# Altium schematic sheet NFC_Access_Ethernet_R00.SchDoc: NFC Access Board
size A4; Author: Hernan M. Travado; CompanyName: UTN FRBA; Revision: 1.0; SheetNumber: 4; SheetTotal: 7
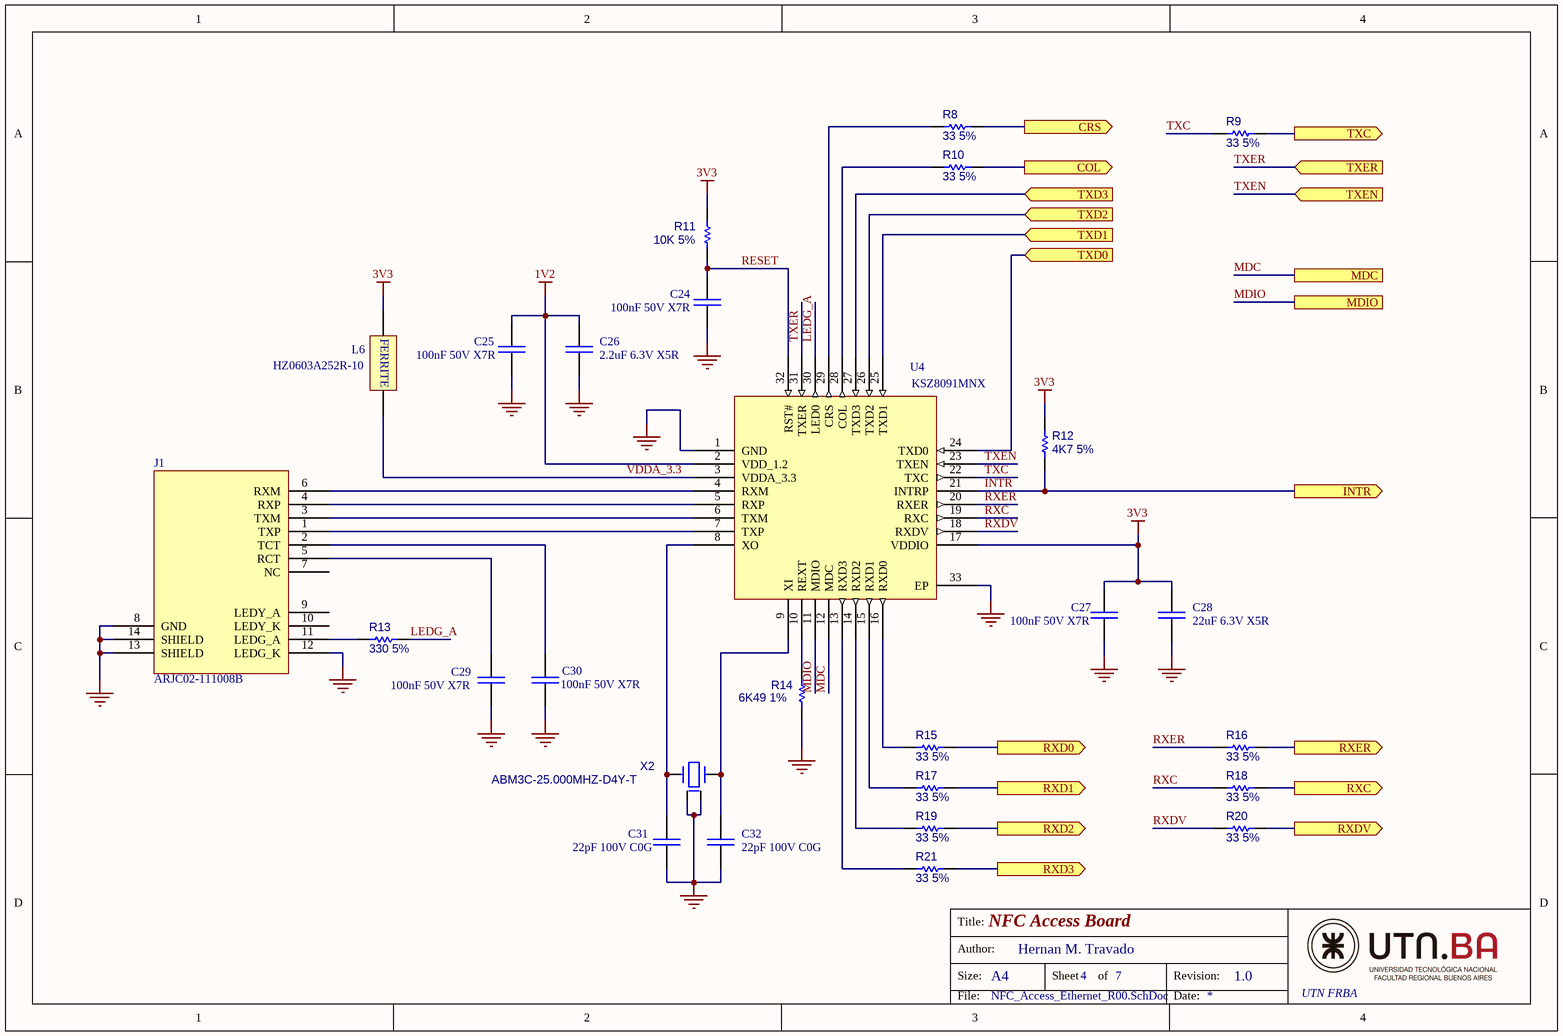
[diagram p0: NFC_Access_Ethernet_R00.SchDoc]

## Parts
C24  100nF 50V X7R  [C_0603]
C25  100nF 50V X7R  [C_0603]
C26  2.2uF 6.3V X5R  [C_0603]
C27  100nF 50V X7R  [C_0603]
C28  22uF 6.3V X5R  [C_0603]
C29  100nF 50V X7R  [C_0603]
C30  100nF 50V X7R  [C_0603]
C31  22pF 100V C0G  [C_0603]
C32  22pF 100V C0G  [C_0603]
J1  ARJC02-111008B  [ARJC02-111008B]
L6  HZ0603A252R-10  [F_0603]
R8  33 5%  [R_0603]
R9  33 5%  [R_0603]
R10  33 5%  [R_0603]
R11  10K 5%  [R_0603]
R12  4K7 5%  [R_0603]
R13  330 5%  [R_0603]
R14  6K49 1%  [R_0603]
R15  33 5%  [R_0603]
R16  33 5%  [R_0603]
R17  33 5%  [R_0603]
R18  33 5%  [R_0603]
R19  33 5%  [R_0603]
R20  33 5%  [R_0603]
R21  33 5%  [R_0603]
U4  KSZ8091MNX  [QFN32]
X2  ABM3C-25.000MHZ-D4Y-T  [ABM3C]

## Ports
COL (out, see NFC_Access_MainPage_R00[3B], NFC_Access_CPU1_R00[2A]), CRS (out, see NFC_Access_MainPage_R00[3B], NFC_Access_CPU1_R00[2A]), INTR (out, see NFC_Access_MainPage_R00[3B], NFC_Access_CPU1_R00[3A]), MDC (see NFC_Access_MainPage_R00[3B], NFC_Access_CPU1_R00[3A]), MDIO (see NFC_Access_MainPage_R00[3B], NFC_Access_CPU1_R00[2A]), RXC (out, see NFC_Access_MainPage_R00[3B], NFC_Access_CPU1_R00[2A]), RXD0 (out, see NFC_Access_MainPage_R00[3A], NFC_Access_CPU1_R00[3A]), RXD1 (out, see NFC_Access_MainPage_R00[3B], NFC_Access_CPU1_R00[3A]), RXD2 (out, see NFC_Access_MainPage_R00[3B], NFC_Access_CPU1_R00[2B]), RXD3 (out, see NFC_Access_MainPage_R00[3B], NFC_Access_CPU1_R00[2B]), RXDV (out, see NFC_Access_MainPage_R00[3B], NFC_Access_CPU1_R00[2A]), RXER (out, see NFC_Access_MainPage_R00[3B], NFC_Access_CPU1_R00[2C]), TXC (out, see NFC_Access_MainPage_R00[3B], NFC_Access_CPU1_R00[3A]), TXD0 (in, see NFC_Access_MainPage_R00[3B], NFC_Access_CPU1_R00[2C]), TXD1 (in, see NFC_Access_MainPage_R00[3B], NFC_Access_CPU1_R00[2C]), TXD2 (in, see NFC_Access_MainPage_R00[3B], NFC_Access_CPU1_R00[3A]), TXD3 (in, see NFC_Access_MainPage_R00[3B], NFC_Access_CPU1_R00[3C]), TXEN (in, see NFC_Access_MainPage_R00[3B], NFC_Access_CPU1_R00[2C]), TXER (in, see NFC_Access_MainPage_R00[3B], NFC_Access_CPU1_R00[3A])

## Nets
1V2: C25.1 C26.1 U4.2(VDD_1.2)
3V3: C27.1 C28.1 L6.1 R11.1 R12.1 U4.17(VDDIO)
GND: C24.2 C25.2 C26.2 C27.2 C28.2 C29.2 C30.2 C31.2 C32.2 J1.8(GND) J1.12(LEDG_K) J1.13(SHIELD) J1.14(SHIELD) R14.2 U4.1(GND) U4.33(EP) X2.2 X2.4
COL: R10.2 ; port COL
CRS: R8.2 ; port CRS
INTR: R12.2 U4.21(INTRP) ; port INTR
LEDG_A: R13.1 U4.30(LED0)
MDC: U4.12(MDC) ; port MDC
MDIO: U4.11(MDIO) ; port MDIO
RESET: C24.1 R11.2 U4.32(RST#)
RXC: R18.1 U4.19(RXC)
RXC: R18.2 ; port RXC  [a separate net that carries the same name]
RXD0: R15.2 ; port RXD0
RXD1: R17.2 ; port RXD1
RXD2: R19.2 ; port RXD2
RXD3: R21.2 ; port RXD3
RXDV: R20.1 U4.18(RXDV)
RXDV: R20.2 ; port RXDV  [a separate net that carries the same name]
RXER: R16.1 U4.20(RXER)
RXER: R16.2 ; port RXER  [a separate net that carries the same name]
TXC: R9.1 U4.22(TXC)
TXC: R9.2 ; port TXC  [a separate net that carries the same name]
TXD0: U4.24(TXD0) ; port TXD0
TXD1: U4.25(TXD1) ; port TXD1
TXD2: U4.26(TXD2) ; port TXD2
TXD3: U4.27(TXD3) ; port TXD3
TXEN: U4.23(TXEN) ; port TXEN
TXER: U4.31(TXER) ; port TXER
VDDA_3.3: L6.2 U4.3(VDDA_3.3)
NetC29_1: C29.1 J1.5(RCT)
NetC30_1: C30.1 J1.2(TCT)
NetC31_1: C31.1 U4.8(XO) X2.3
NetC32_1: C32.1 U4.9(XI) X2.1
NetJ1_1: J1.1(TXP) U4.7(TXP)
NetJ1_3: J1.3(TXM) U4.6(TXM)
NetJ1_4: J1.4(RXP) U4.5(RXP)
NetJ1_6: J1.6(RXM) U4.4(RXM)
NetJ1_11: J1.11(LEDG_A) R13.2
NetR8_1: R8.1 U4.29(CRS)
NetR10_1: R10.1 U4.28(COL)
NetR14_1: R14.1 U4.10(REXT)
NetR15_1: R15.1 U4.16(RXD0)
NetR17_1: R17.1 U4.15(RXD1)
NetR19_1: R19.1 U4.14(RXD2)
NetR21_1: R21.1 U4.13(RXD3)

Not connected (* = marked no-connect by the designer): J1 7(NC) 9(LEDY_A) 10(LEDY_K)

## Notes on the sheet
- Title:
- Size:
- Author:
- A4
- Sheet
- of
- Revision:
- File:
- Date:

## Library data of the parts
C24 C25 C27 C29 C30 = Ceramic capacitor: Ceramic Capacitor / 1276-1018-2-ND
C26 = Ceramic capacitor: Ceramic Capacitor / 1276-1183-2-ND
C28 = Ceramic capacitor: Ceramic Capacitor / 1276-1193-2-ND
C31 C32 = Ceramic capacitor: Ceramic Capacitor / 490-4942-2-ND
J1 = SI-46001-F: RJ45 with Magentics / 535-12605-ND
L6 = FERRITE: Ferrite Bead / 240-2561-2-ND
R8-R10 R15-R21 = Res1: Resistor / 118-CR0603-JW-330ELFTR-ND
R11 = Res1: Resistor / CR0603-JW-103ELFTR-ND
R12 = Res1: Resistor / CR0603-JW-472ELFTR-ND
R13 = Res1: Resistor / CR0603-JW-331ELFTR-ND
R14 = Res1: Resistor / CR0603-FX-6491ELFTR-ND
U4 = KSZ8091MNX: IC TRANSCEIVER FULL 1/1 32QFN / KSZ8091MNXIA-TR-ND
X2 = CRYSTAL_4P: Crystal 4 Vias + GND 25.00MHz / 535-11296-2-ND